# EAGLE design oresat-batteries-v1.1 (EAGLE 8.3.2)
Oresat Battery Management Board v0 Andrew Greenberg Austin Joseph Haneef Mubarak
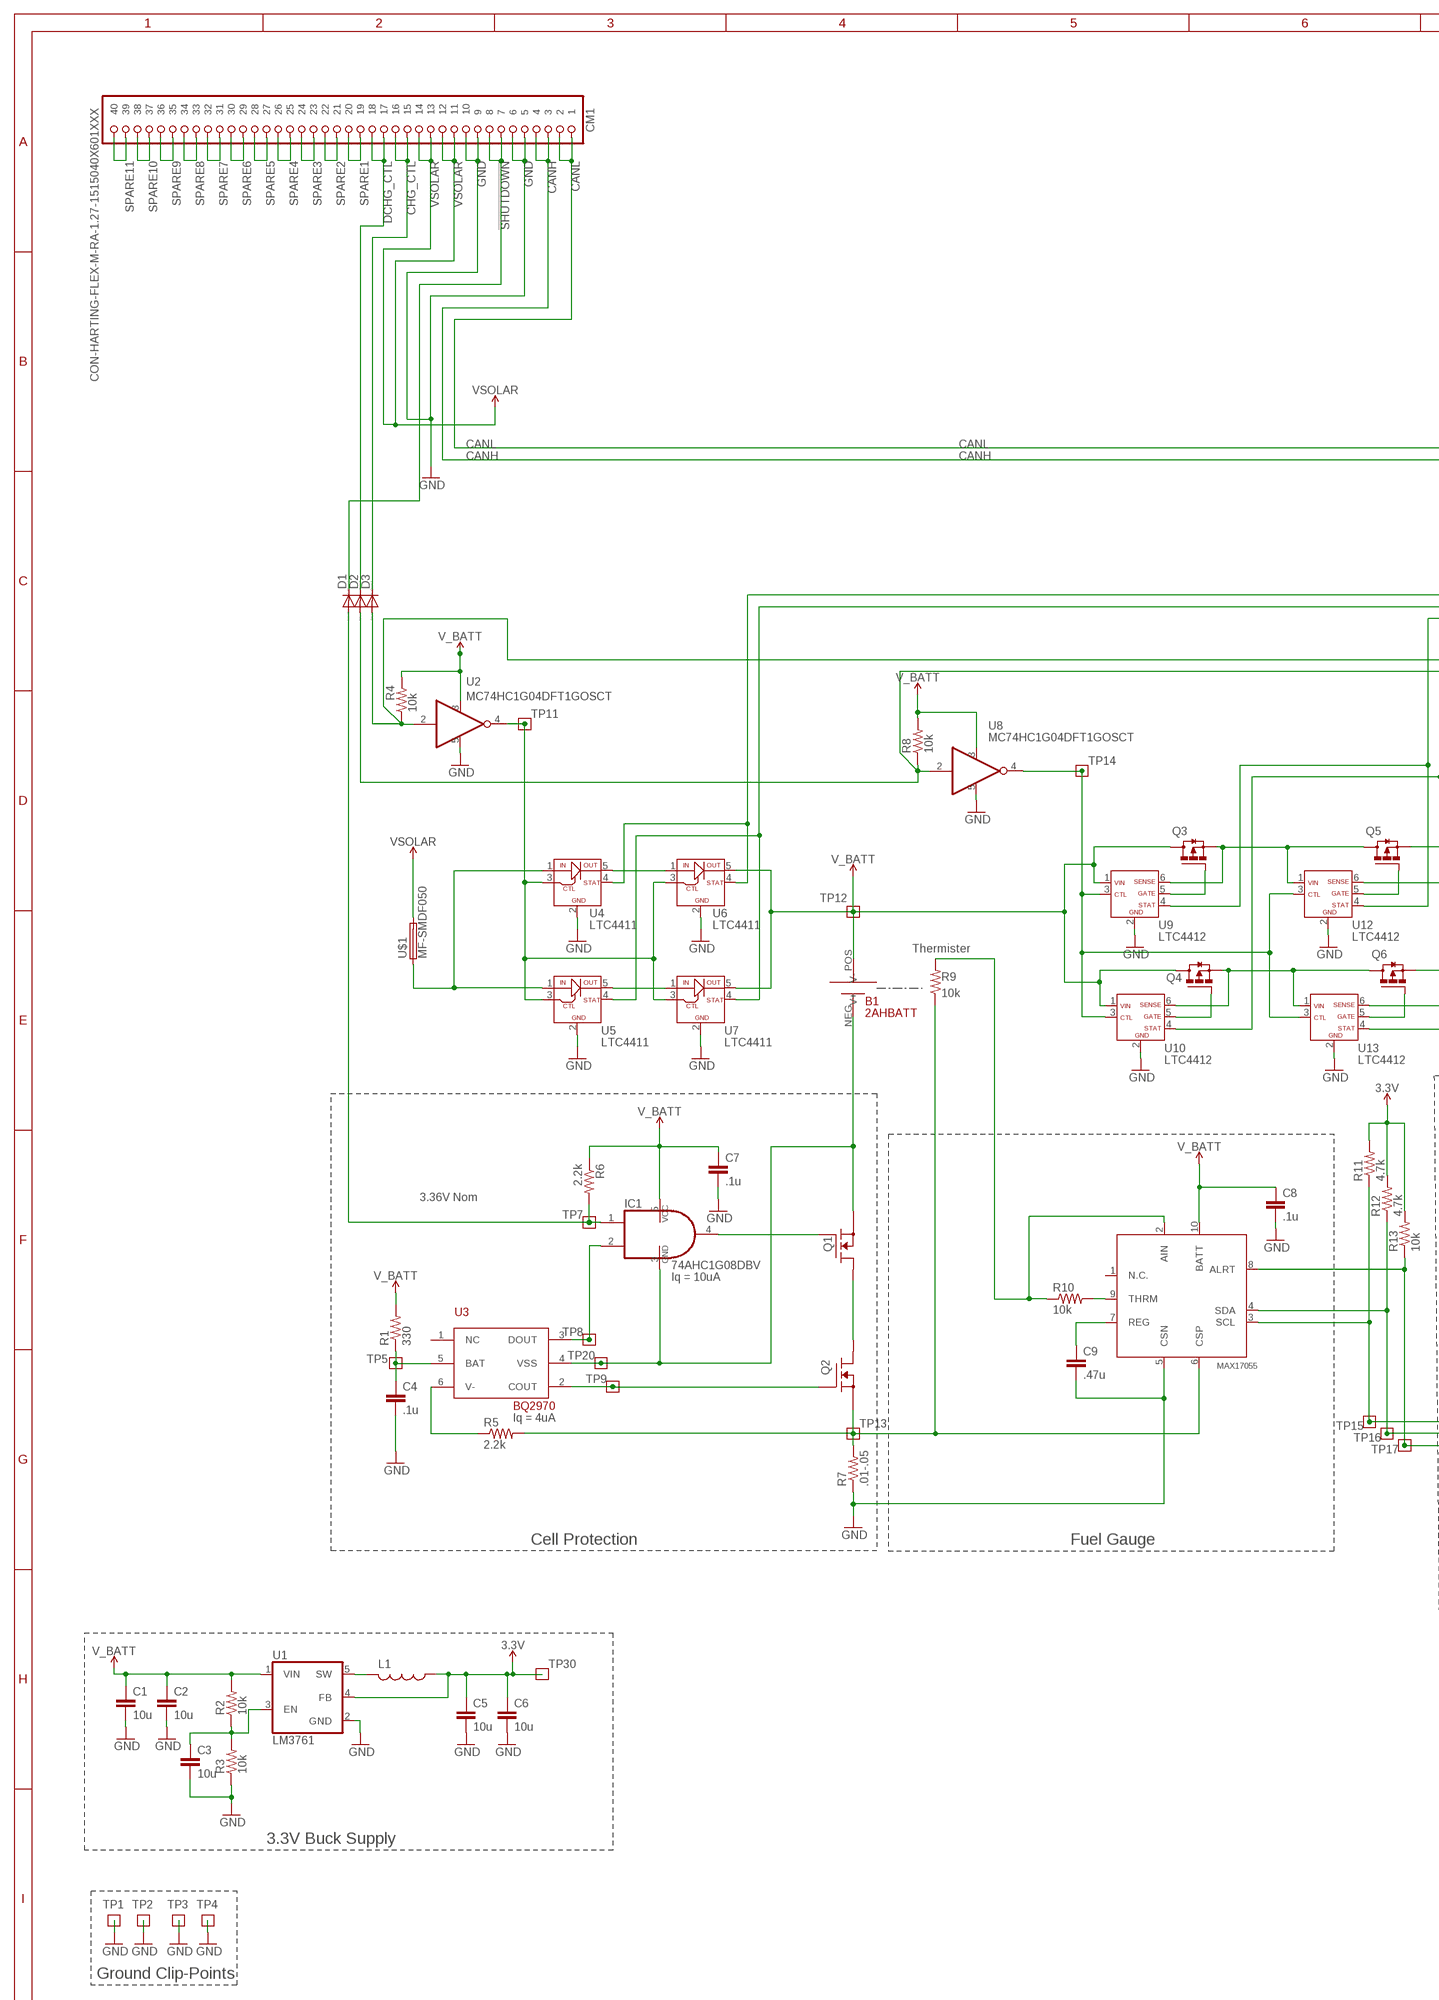
[diagram p0: schematic, sheet 1, part 1 of 2]
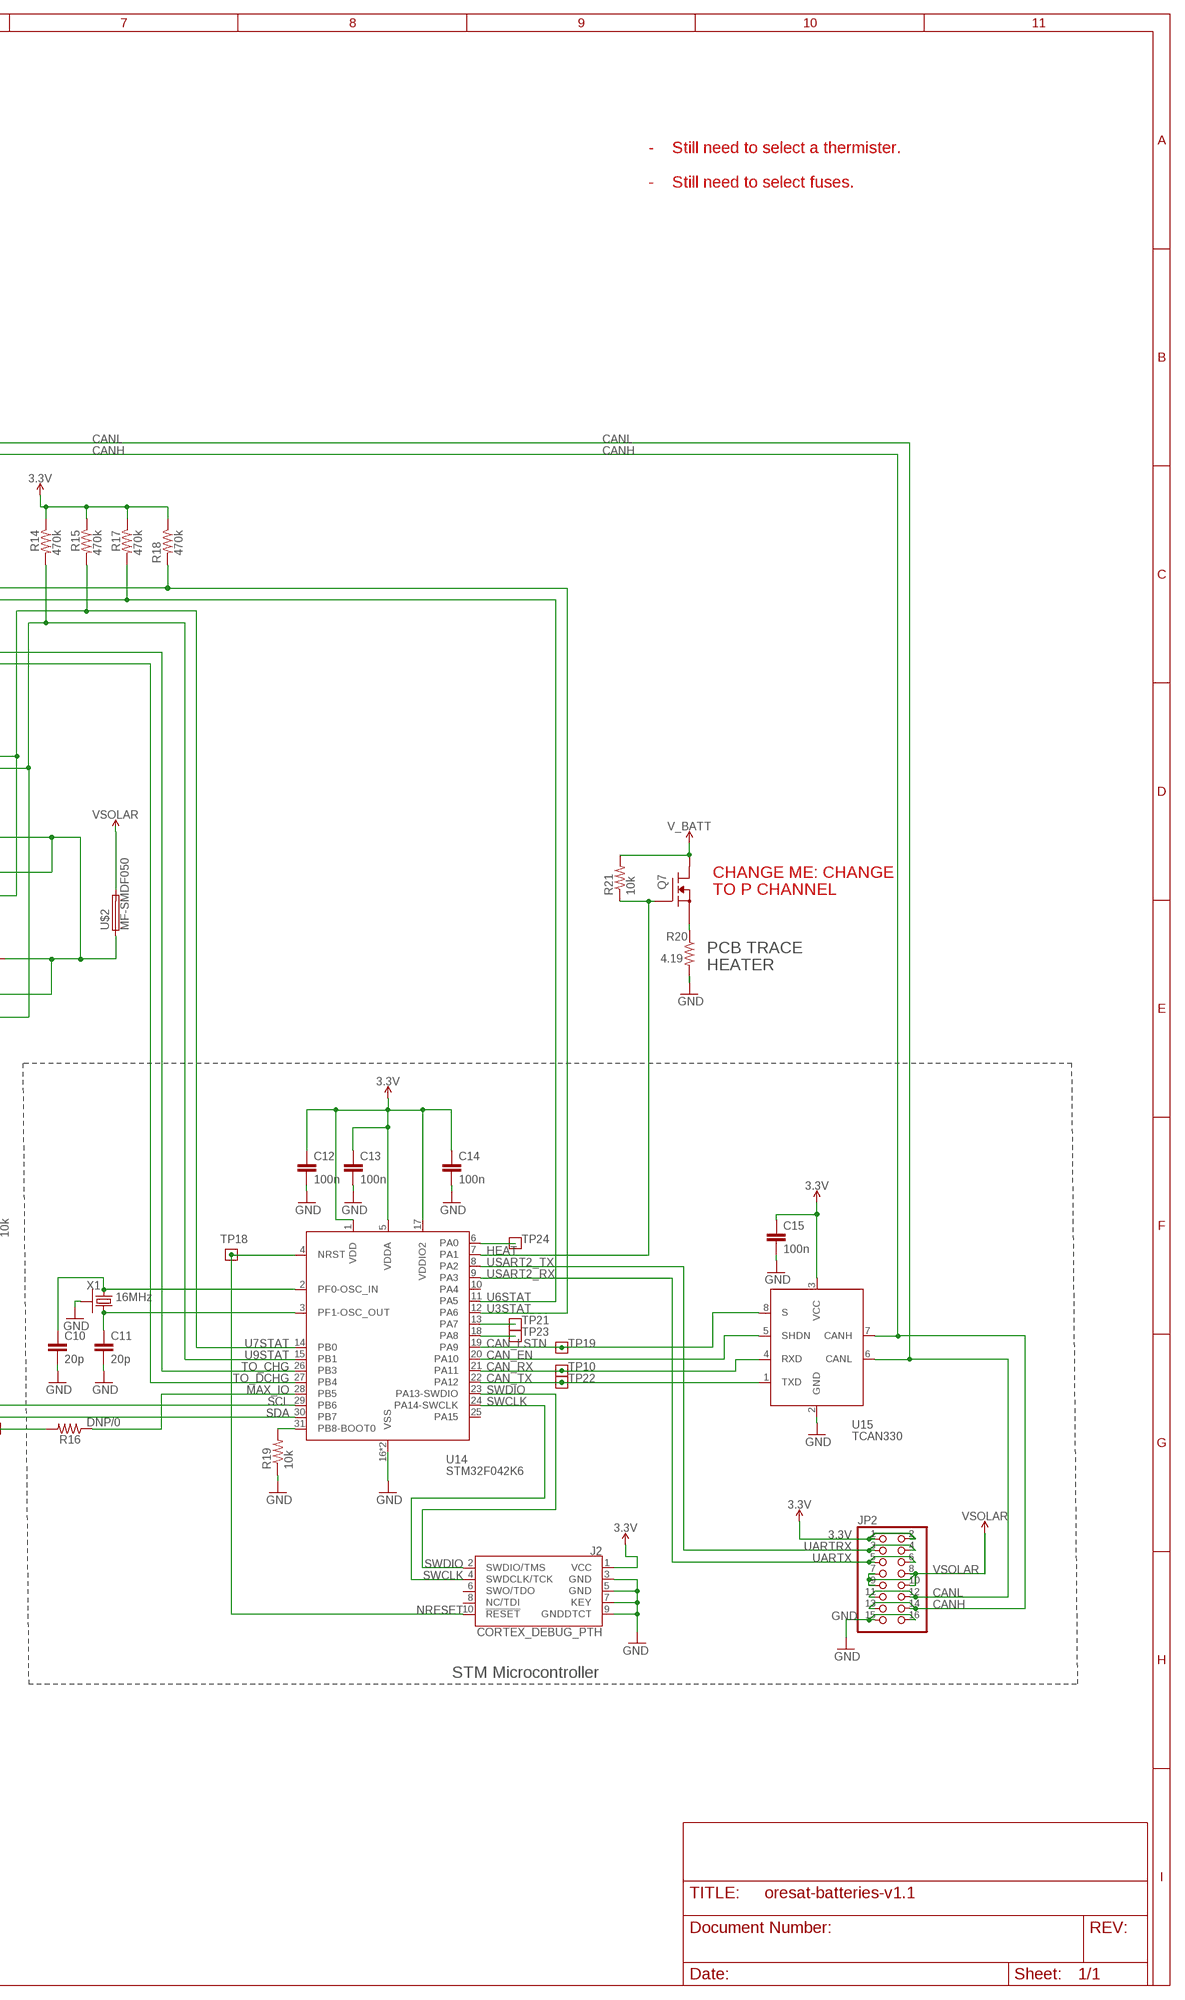
[diagram p1: schematic, sheet 1, part 2 of 2]

## Parts
B1  2AHBATT  [2AH_605060]
C1  10u  C-EUC0805  [C0805]
C2  10u  C-EUC0805  [C0805]
C3  10u  C-EUC0805  [C0805]
C4  .1u  C-EUC0603  [C0603]
C5  10u  C-EUC0805  [C0805]
C6  10u  C-EUC0805  [C0805]
C7  .1u  C-EUC0603  [C0603]
C8  .1u  C-EUC0603  [C0603]
C9  .47u  C-EUC0603  [C0603]
C10  20p  C-EUC0603  [C0603]
C11  20p  C-EUC0603  [C0603]
C12  100n  C-EUC0603  [C0603]
C13  100n  C-EUC0603  [C0603]
C14  100n  C-EUC0603  [C0603]
C15  100n  C-EUC0603  [C0603]
CM1  CON-HARTING-FLEX-M-RA-1.27-1515040X601XXX  [CON-1.27-M-RA-HARTING-1515040X601XXX]
D1  CMDD6001  [SOD323]
D2  CMDD6001  [SOD323]
D3  CMDD6001  [SOD323]
IC1  74AHC1G08DBV  [SOT23-5]
J2  CORTEX_DEBUG_PTH  [2X5-PTH-1.27MM]
JP2  PINHD-2X8  [2X08]
L1  L-USL2012C  [L2012C]
Q1  CSD16340Q3  [Q3]
Q2  CSD16340Q3  [Q3]
Q3  TPN4R712MD  [TSON-ADVANCE-3X3]
Q4  TPN4R712MD  [TSON-ADVANCE-3X3]
Q5  TPN4R712MD  [TSON-ADVANCE-3X3]
Q6  TPN4R712MD  [TSON-ADVANCE-3X3]
Q7  CSD16340Q3  [Q3]
R1  330  R-US_R0603  [R0603]
R2  10k  R-US_R0603  [R0603]
R3  10k  R-US_R0603  [R0603]
R4  10k  R-US_R0603  [R0603]
R5  2.2k  R-US_R0603  [R0603]
R6  2.2k  R-US_R0603  [R0603]
R7  .01-.05  R-US_R2512  [R2512]
R8  10k  R-US_R0603  [R0603]
R9  10k  R-US_R0603  [R0603]
R10  10k  R-US_R0603  [R0603]
R11  4.7k  R-US_R0603  [R0603]
R12  4.7k  R-US_R0603  [R0603]
R13  10k  R-US_R0603  [R0603]
R14  470k  R-US_R0603  [R0603]
R15  470k  R-US_R0603  [R0603]
R16  DNP/0  R-US_R0603  [R0603]
R17  470k  R-US_R0603  [R0603]
R18  470k  R-US_R0603  [R0603]
R19  10k  R-US_R0603  [R0603]
R20  4.19  RES_HEATER  [RES_HEATER]
R21  10k  R-US_R0603  [R0603]
TP1  TP  [2MM_TP]
TP2  TP  [2MM_TP]
TP3  TP  [2MM_TP]
TP4  TP  [2MM_TP]
TP5  TP  [2MM_TP]
TP7  TP  [2MM_TP]
TP8  TP  [2MM_TP]
TP9  TP  [2MM_TP]
TP10  TP  [2MM_TP]
TP11  TP  [2MM_TP]
TP12  TP  [2MM_TP]
TP13  TP  [2MM_TP]
TP14  TP  [2MM_TP]
TP15  TP  [2MM_TP]
TP16  TP  [2MM_TP]
TP17  TP  [2MM_TP]
TP18  TP  [2MM_TP]
TP19  TP  [2MM_TP]
TP20  TP  [2MM_TP]
TP21  TP  [2MM_TP]
TP22  TP  [2MM_TP]
TP23  TP  [2MM_TP]
TP24  TP  [2MM_TP]
TP30  TP  [2MM_TP]
U1  LM3761  [SOT23-5]
U2  MC74HC1G04DFT1GOSCT  [SC70-5]
U3  BQ2970  [PSOP6]
U4  LTC4411  [SOT23-5-B]
U5  LTC4411  [SOT23-5-B]
U6  LTC4411  [SOT23-5-B]
U7  LTC4411  [SOT23-5-B]
U8  MC74HC1G04DFT1GOSCT  [SC70-5]
U9  LTC4412  [SOT23-6]
U10  LTC4412  [SOT23-6]
U11  MAX17055  [TDFN-10L]
U12  LTC4412  [SOT23-6]
U13  LTC4412  [SOT23-6]
U14  STM32F042K6  [QFP32-7X7]
U15  TCAN330  [SOT23-8_TI-DCN]
U$1  MF-SMDF050  [MF-SMDF050]
U$2  MF-SMDF050  [MF-SMDF050]
X1  16MHz  CRYSTAL-WITH-GND  [CRYSTAL_2.5X2]

## Nets
3.3V: C5.1 C6.1 C12.1 C13.1 C14.1 C15.1 J2.1(VCC) JP2.1 JP2.2 L1.1 R11.2 R12.2 R13.2 R14.1 R15.1 R17.1 R18.1 TP30.P$1 U1.4(FB) U14.1(VDD) U14.5(VDDA) U14.17(VDDIO2) U15.3(VCC)
4411_MT: U4.5(OUT) U6.1(IN)
4411MB: U5.5(OUT) U7.1(IN)
!SHUTDOWN: CM1.7 CM1.8 D1.1(C)
ALERT: R13.1 R16.2 TP17.P$1 U11.8(ALRT)
ANDDRIVE: IC1.4(O) Q1.P$4(G)
BATT-: B1.NEG(V-) IC1.3(GND) Q1.P$1(S) Q1.P$2(S) Q1.P$3(S) TP20.P$1 U3.4(VSS)
BETSHUT: Q1.P$5(D) Q1.P$6(D) Q1.P$7(D) Q1.P$8(D) Q1.P$9(D) Q2.P$5(D) Q2.P$6(D) Q2.P$7(D) Q2.P$8(D) Q2.P$9(D)
BGDOUT: IC1.2(I1) TP8.P$1 U3.3(DOUT)
BQBAT: C4.1 R1.1 TP5.P$1 U3.5(BAT)
BQCOUT: Q2.P$4(G) TP9.P$1 U3.2(COUT)
BQVMIN: R5.1 U3.6(V-)
C_SENSE: Q2.P$1(S) Q2.P$2(S) Q2.P$3(S) R5.2 R7.2 R9.1 TP13.P$1 U11.6(CSP)
CAN_EN: U14.20(PA10) U15.5(SHDN)
CAN_LSTN: TP19.P$1 U14.19(PA9) U15.8(S)
CAN_RX: TP10.P$1 U14.21(PA11) U15.4(RXD)
CAN_TX: TP22.P$1 U14.22(PA12) U15.1(TXD)
CANH: CM1.3 CM1.4 JP2.13 JP2.14 U15.7(CANH)
CANL: CM1.1 CM1.2 JP2.11 JP2.12 U15.6(CANL)
CHG_CTL: CM1.15 CM1.16 D3.1(C)
CHG_SHD: TP11.P$1 U2.4(OUT) U4.3(CTL) U5.3(CTL) U6.3(CTL) U7.3(CTL)
DCHG_CTL: CM1.17 CM1.18 D2.1(C)
DSCHG_SHD: TP14.P$1 U8.4(OUT) U9.3(CTL) U10.3(CTL) U12.3(CTL) U13.3(CTL)
GND: C1.2 C2.2 C3.2 C4.2 C5.2 C6.2 C7.2 C8.2 C9.2 C10.2 C11.2 C12.2 C13.2 C14.2 C15.2 CM1.5 CM1.6 CM1.9 CM1.10 J2.3(GND) J2.5(GND) J2.7(KEY) J2.9(GNDDTCT) JP2.15 JP2.16 R3.1 R7.1 R19.1 R20.V- TP1.P$1 TP2.P$1 TP3.P$1 TP4.P$1 U1.2(GND) U2.5(GND) U4.2(GND) U5.2(GND) U6.2(GND) U7.2(GND) U8.5(GND) U9.2(GND) U10.2(GND) U11.5(CSN) U12.2(GND) U13.2(GND) U14.16(VSS) U14.32(VSS) U15.2(GND) X1.2(SHIELD) X1.4(SHIELD)
HEAT: Q7.P$4(G) R21.1 U14.7(PA1)
INFUSE: U4.1(IN) U5.1(IN) U$1.1
MAX_IO: R16.1 U14.28(PB5)
N$1: L1.2 U1.5(SW)
N$2: R19.2 U14.31(PB8-BOOT0)
N$4: TP23.P$1 U14.18(PA8)
N$7: C3.1 R2.1 R3.2 U1.3(EN)
N$8: Q5.4(G) U12.5(GATE)
N$11: Q3.1(S) Q3.2(S) Q3.3(S) Q5.5(D) Q5.6(D) Q5.7(D) Q5.8(D) U9.6(SENSE) U12.1(VIN)
N$12: Q3.4(G) U9.5(GATE)
N$13: Q7.P$1(S) Q7.P$2(S) Q7.P$3(S) R20.V+
N$14: TP24.P$1 U14.6(PA0)
N$16: Q6.4(G) U13.5(GATE)
N$18: Q4.1(S) Q4.2(S) Q4.3(S) Q6.5(D) Q6.6(D) Q6.7(D) Q6.8(D) U10.6(SENSE) U13.1(VIN)
N$19: Q4.4(G) U10.5(GATE)
NRESET: J2.10(!RESET) TP18.P$1 U14.4(NRST)
OSC_IN: C10.1 U14.2(PF0-OSC_IN) X1.1
OSC_OUT: C11.1 U14.3(PF1-OSC_OUT) X1.3
OUTFUSE: Q5.1(S) Q5.2(S) Q5.3(S) Q6.1(S) Q6.2(S) Q6.3(S) U12.6(SENSE) U13.6(SENSE) U$2.1
REG: C9.1 U11.7(REG)
SCL: R11.1 TP15.P$1 U11.3(SCL) U14.29(PB6)
SDA: R12.1 TP16.P$1 U11.4(SDA) U14.30(PB7)
SPARE1: CM1.19 CM1.20
SPARE2: CM1.21 CM1.22
SPARE3: CM1.23 CM1.24
SPARE4: CM1.25 CM1.26
SPARE5: CM1.27 CM1.28
SPARE6: CM1.29 CM1.30
SPARE7: CM1.31 CM1.32
SPARE8: CM1.33 CM1.34
SPARE9: CM1.35 CM1.36
SPARE10: CM1.37 CM1.38
SPARE11: CM1.39 CM1.40
SWCLK: J2.4(SWDCLK/TCK) U14.24(PA14-SWCLK)
SWDIO: J2.2(SWDIO/TMS) U14.23(PA13-SWDIO)
SYSSHD: D1.2(A) IC1.1(I0) R6.2 TP7.P$1
TEMPSENSE: R9.2 R10.1 U11.2(AIN)
THRM: R10.2 U11.9(THRM)
TO_CHG: D3.2(A) R4.1 U2.2(INA) U14.26(PB3)
TO_DCHG: D2.2(A) R8.1 U8.2(INA) U14.27(PB4)
TP21: TP21.P$1 U14.13(PA7)
U3STAT: R18.2 U4.4(STAT) U6.4(STAT) U14.12(PA6)
U6STAT: R17.2 U5.4(STAT) U7.4(STAT) U14.11(PA5)
U7STAT: R15.2 U9.4(STAT) U12.4(STAT) U14.14(PB0)
U9STAT: R14.2 U10.4(STAT) U13.4(STAT) U14.15(PB1)
USART2_RX: JP2.5 JP2.6 U14.9(PA3)
USART2_TX: JP2.3 JP2.4 U14.8(PA2)
V_BATT: B1.POS(V+) C1.1 C2.1 C7.1 C8.1 IC1.5(VCC) Q3.5(D) Q3.6(D) Q3.7(D) Q3.8(D) Q4.5(D) Q4.6(D) Q4.7(D) Q4.8(D) Q7.P$5(D) Q7.P$6(D) Q7.P$7(D) Q7.P$8(D) Q7.P$9(D) R1.2 R2.2 R4.2 R6.1 R8.2 R21.2 TP12.P$1 U1.1(VIN) U2.3(VCC) U6.5(OUT) U7.5(OUT) U8.3(VCC) U9.1(VIN) U10.1(VIN) U11.10(BATT)
VSOLAR: CM1.11 CM1.12 CM1.13 CM1.14 JP2.7 JP2.8 JP2.9 JP2.10 U$1.2 U$2.2
Unconnected: J2.6(SWO/TDO) J2.8(NC/TDI) U3.1(NC) U11.1(N.C.) U14.10(PA4) U14.25(PA15)

## Notes on the sheet
- -    Still need to select a thermister.
  
  -    Still need to select fuses.
- CHANGE ME: CHANGE 
  TO P CHANNEL
- Thermister
- PCB TRACE
  HEATER
- 3.36V Nom
- HEAT
- Iq = 10uA | USART2_TX
- USART2_RX
- CAN_LSTN
- CAN_EN
- CAN_RX
- CAN_TX
- SWDIO
- Iq = 4uA | SCL | SWCLK
- SDA
- Cell Protection | Fuel Gauge
- UARTRX
- UARTX
- VSOLAR
- CANL
- CANH
- GND
- STM Microcontroller
- 3.3V Buck Supply
- Ground Clip-Points

## Library data of the parts
B1 = oresat-batteries:2AHBATT
C1-C15 = rcl:C-EU: CAPACITOR, European symbol
CM1 = oresat-eagle:CON-HARTING-FLEX-M-RA-1.27-1515040X601XXX
D1-D3 = CMMDD6001:CMDD6001
IC1 = 74xx-little-us:74*1G08: 2-input AND gate
J2 = SparkFun-Connectors:CORTEX_DEBUG: Cortex Debug Connector - 10 pin Supports JTAG debug, Serial Wire debug, and Serial Wire Viewer. PTH and SMD connector options available. General Connector Information <http://infocenter.arm.com/help/topic/com.arm.doc.faqs/attached/13634/cortex_debug_connectors.pdf> Products: PTH Connector <http://www.digikey.com/product-detail/en/cnc-tech/3220-10-0100-00/1175-1627-ND/3883661> -via Digi-Key SparkFun PSoc <https://www.sparkfun.com/products/13229> SparkFun T <https://www.sparkfun.com/products/13810>
JP2 = pinhead:PINHD-2X8: PIN HEADER
L1 = rcl:L-US: INDUCTOR, American symbol
Q1 Q2 Q7 = oresat-batteries:CSD16340Q3
Q3-Q6 = tpn4r712md-pmosfet:TPN4R712MD
R1-R19 R21 = rcl:R-US_: RESISTOR, American symbol
R20 = oresat-batteries:RES_HEATER
TP1-TP5 TP7-TP24 TP30 = oresat-batteries:TP
U1 = oresat-batteries:LM3761: http://www.digikey.com/product-detail/en/texas-instruments/LM3671MF-3.3-NOPB/LM3671MF-3.3-NOPBCT-ND/1590190
U2 U8 = MC74HC1G04DFT1GOSCT:MC74HC1G04DFT1GOSCT
U3 = oresat-batteries:BQ2970
U4-U7 = ltc4411:LTC4411
U9 U10 U12 U13 = ltc4412:LTC4412
U11 = max17055:MAX17055
U14 = oresat-batteries:STM32F042K6
U15 = oresat-batteries:TCAN330
U$1 U$2 = fuse:MF-SMDF: MF-SMDF Series - PRC Resettable Fuses Source: http://www.farnell.com/datasheets/716597.pdf
X1 = low-gain-radio:CRYSTAL-WITH-GND

## Board
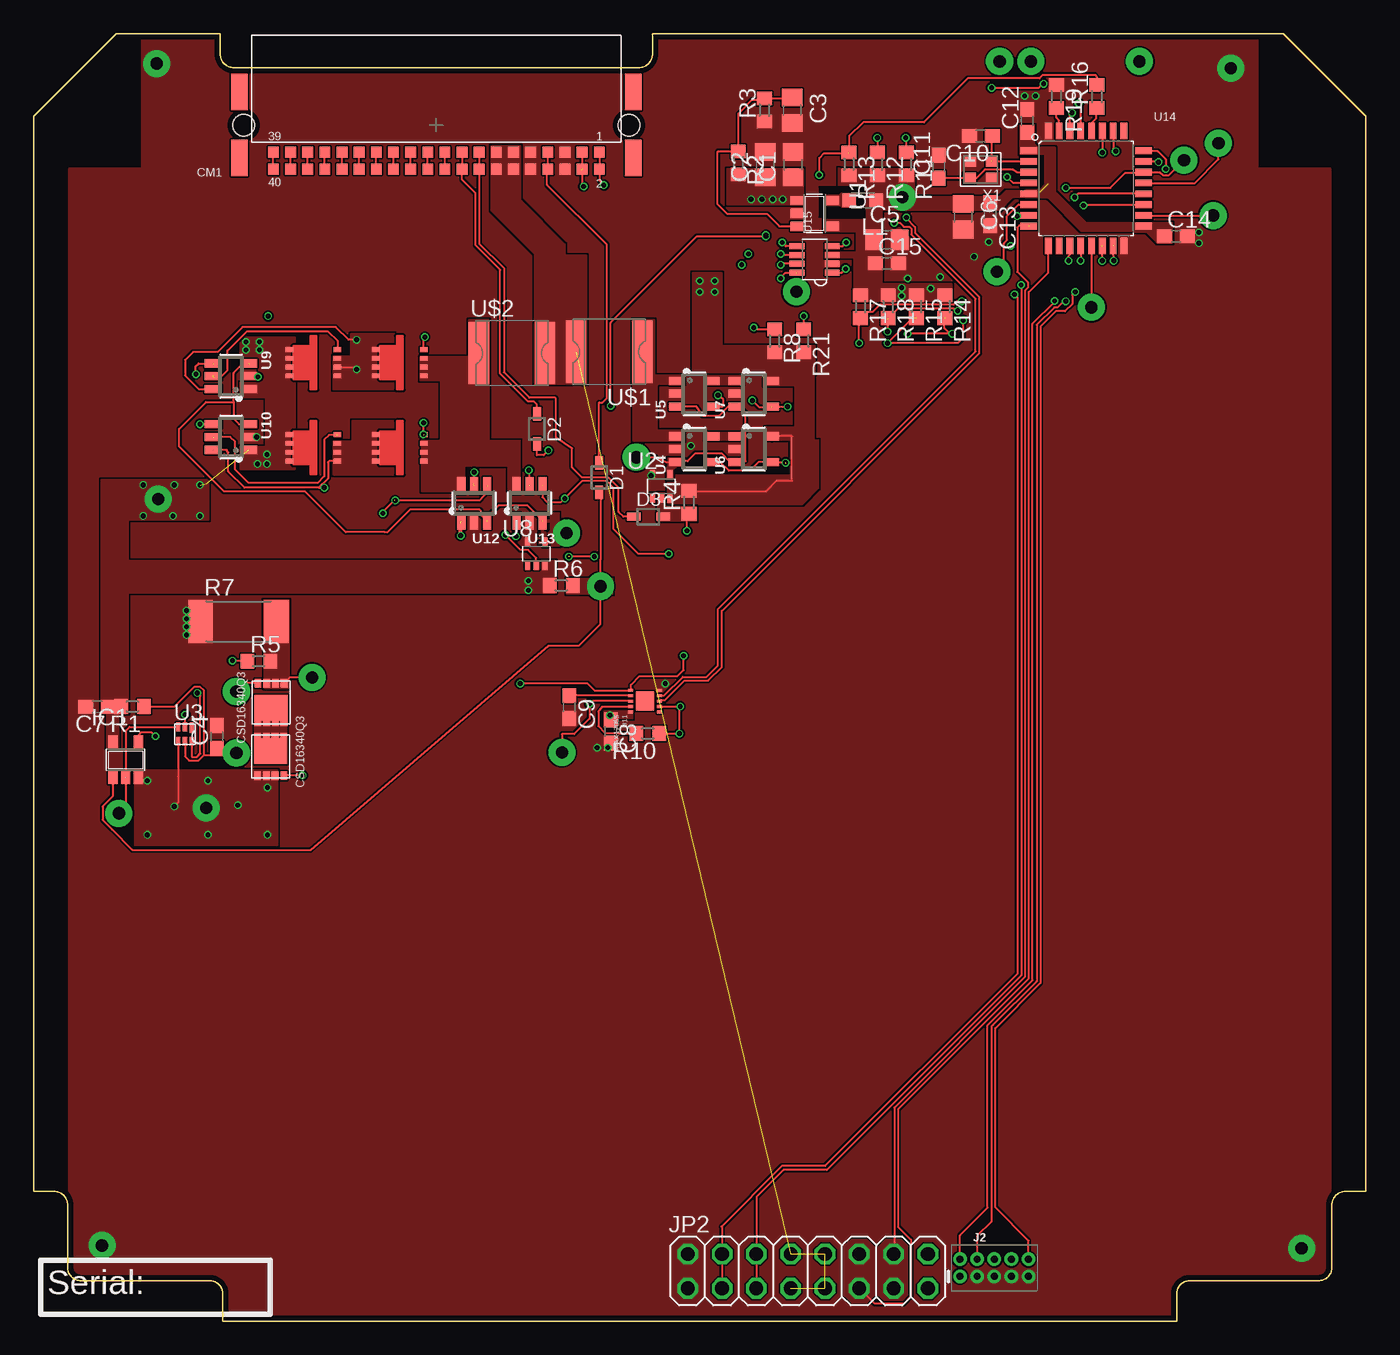
[diagram p2: board, top side]
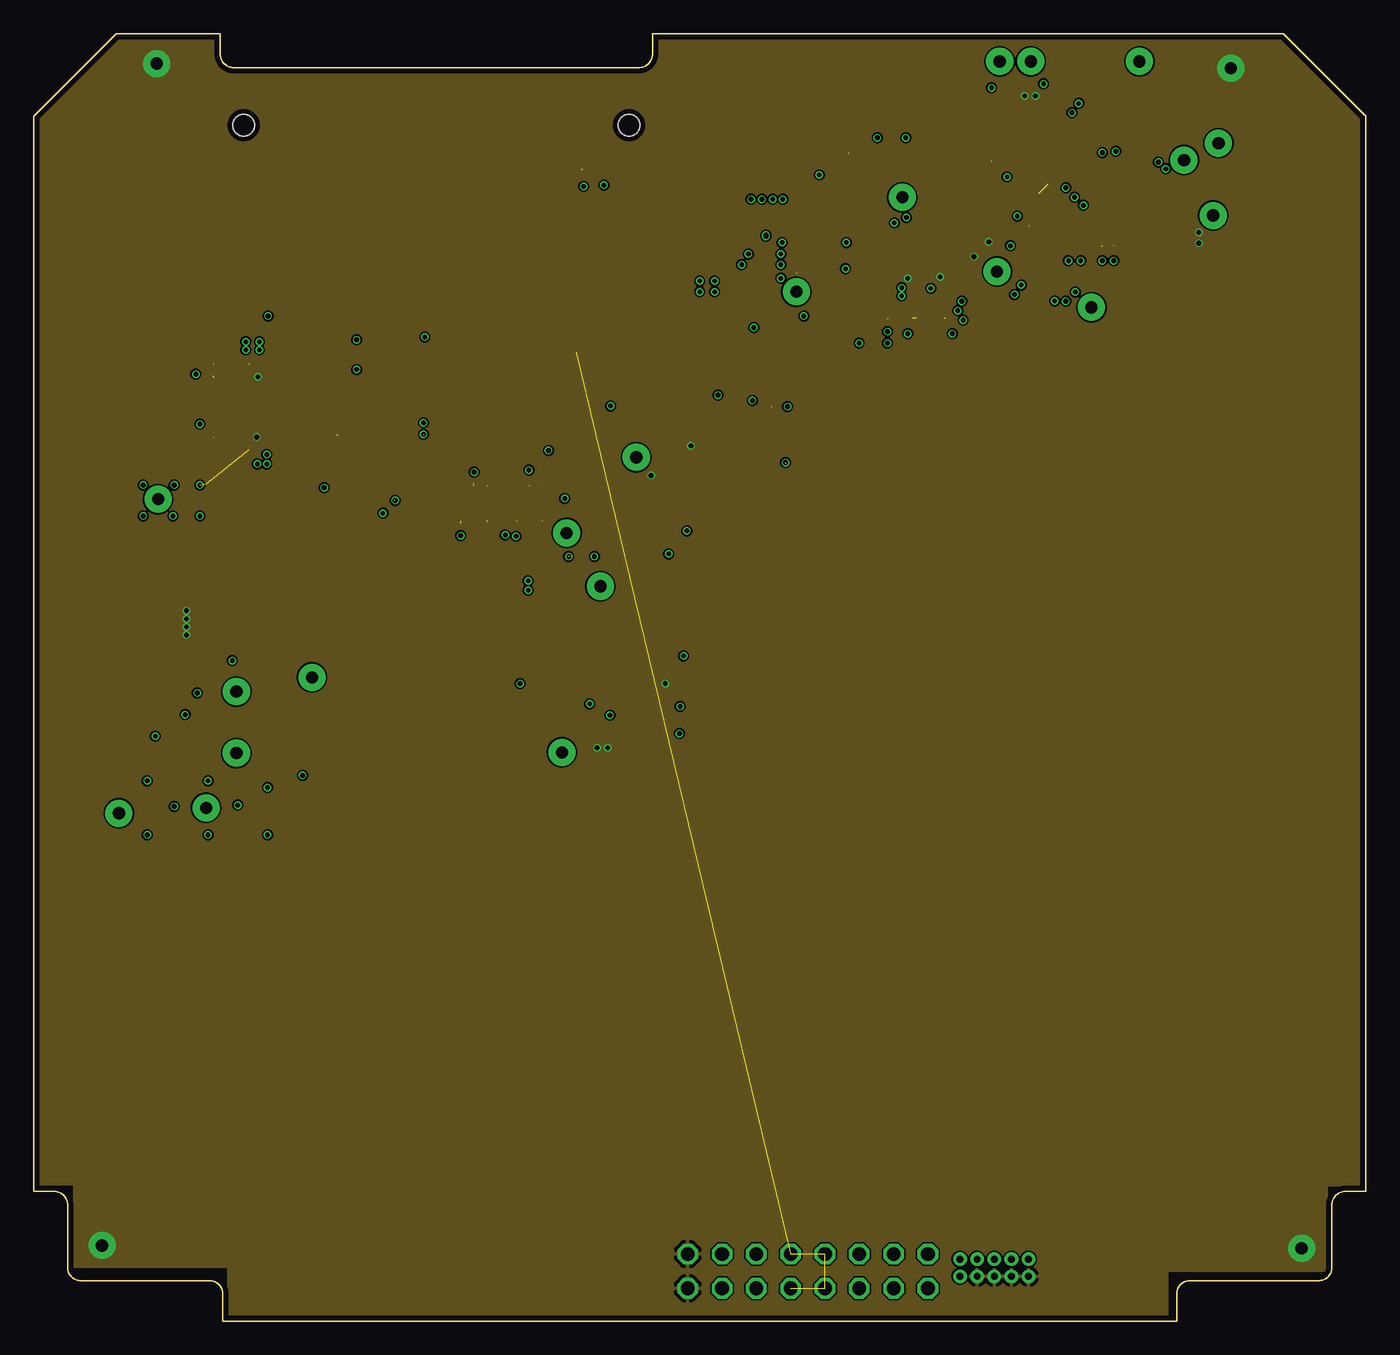
[diagram p3: board, inner layer Route2]
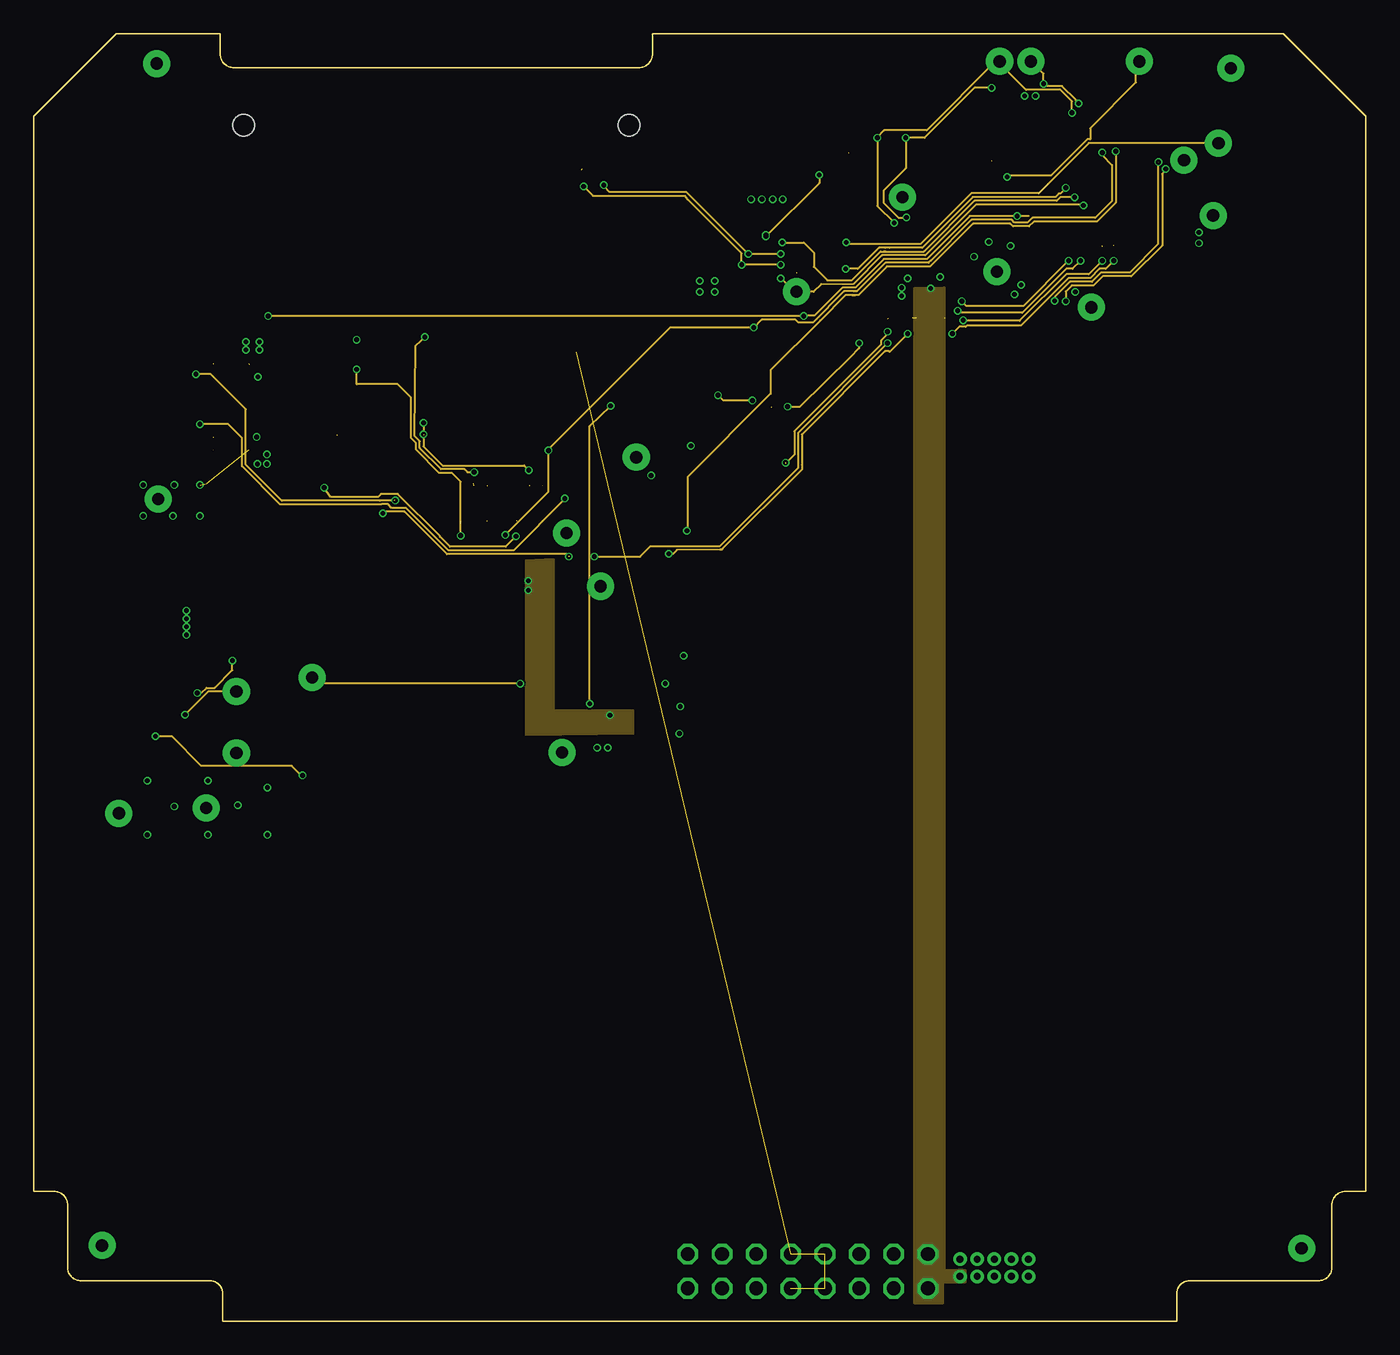
[diagram p4: board, inner layer route]
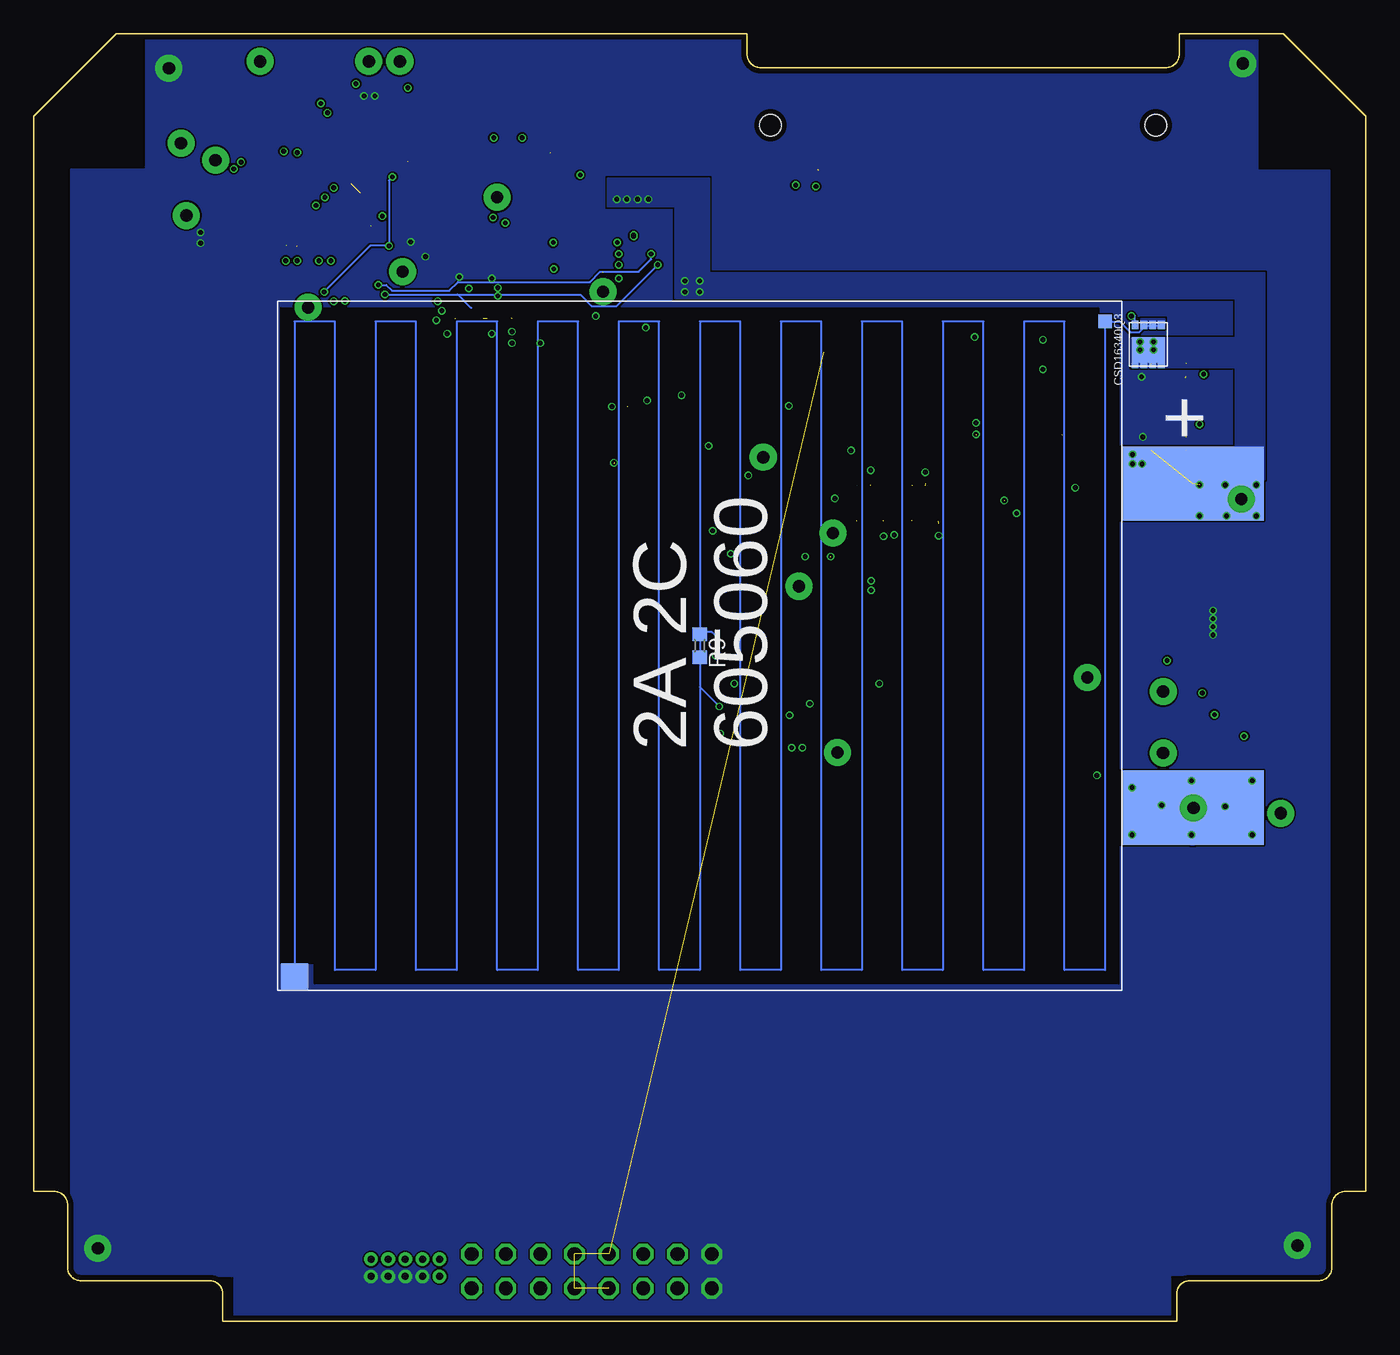
[diagram p5: board, bottom side, seen from below]

Size 98.6 x 95.3 mm. Coordinates in mm from the lower left corner, seen from the top.
Copper layers (1*2*15*16): Top 0.035559375mm / dielectric 0.17018125mm / Route2 0.01778125mm / dielectric 47mil / route 0.01778125mm / dielectric 0.17018125mm / Bottom 0.035559375mm
Design rules "oshpark-4layer": minimum track width 5mil, minimum drill 10mil, track to track 5mil, track to pad 5mil, pad to pad 5mil, via to via 5mil, smd to smd 5mil, copper to edge 15mil, drill to drill 6mil, minimum pad ring 4mil, minimum via ring 4mil, stop-mask expansion 2.5mil, vias tented up to drill 0mil, thermal gap 10mil
tRestrict: area 58.1,81.8 to 61.5,84

### Footprints (pad centres in the part's own frame; a part is rotated, then mirrored left to right if it is on the bottom)
2AH_605060 = smd 5.5 x 10.5: NEG -12,-36.5; POS 12,-36.5
C0805 = smd 1.3 x 1.5: 1 -0.95,0; 2 0.95,0
C0603 = smd 1.1 x 1: 1 -0.85,0; 2 0.85,0
CON-1.27-M-RA-HARTING-1515040X601XXX = smd 0.8 x 0.8: 1 -12.065,2; 2 -12.065,3.27; 3 -10.795,2; 4 -10.795,3.27; 5 -9.525,2; 6 -9.525,3.27; 7 -8.255,2; 8 -8.255,3.27; 9 -6.985,2; 10 -6.985,3.27; 11 -5.715,2; 12 -5.715,3.27; 13 -4.445,2; 14 -4.445,3.27; 15 -3.175,2; 16 -3.175,3.27; 17 -1.905,2; 18 -1.905,3.27; 19 -0.635,2; 20 -0.635,3.27; 21 0.635,2; 22 0.635,3.27; 23 1.905,2; 24 1.905,3.27; 25 3.175,2; 26 3.175,3.27; 27 4.445,2; 28 4.445,3.27; 29 5.715,2; 30 5.715,3.27; 31 6.985,2; 32 6.985,3.27; 33 8.255,2; 34 8.255,3.27; 35 9.525,2; 36 9.525,3.27; 37 10.795,2; 38 10.795,3.27; 39 12.065,2; 40 12.065,3.27 | smd 1.2 x 2.7: PAD1 -14.575,-2.45; PAD2 14.575,-2.45; PAD3 14.575,2.45; PAD4 -14.575,2.45 | hole 1.6: 14.275,0; -14.275,0
SOD323 = smd 1 x 0.6: 1 -1.1,0; 2 1.1,0
SOT23-5 = smd 0.69 x 0.99: 1 -0.95,-1.29; 2 0,-1.29; 3 0.95,-1.29; 4 0.95,1.3; 5 -0.95,1.3
2X5-PTH-1.27MM = drill 0.508 pad 1: 1 -2.54,-0.635; 2 -2.54,0.635; 3 -1.27,-0.635; 4 -1.27,0.635; 5 0,-0.635; 6 0,0.635; 7 1.27,-0.635; 8 1.27,0.635; 9 2.54,-0.635; 10 2.54,0.635
2X08 = drill 1.016 octagon: 1 -8.89,-1.27; 2 -8.89,1.27; 3 -6.35,-1.27; 4 -6.35,1.27; 5 -3.81,-1.27; 6 -3.81,1.27; 7 -1.27,-1.27; 8 -1.27,1.27; 9 1.27,-1.27; 10 1.27,1.27; 11 3.81,-1.27; 12 3.81,1.27; 13 6.35,-1.27; 14 6.35,1.27; 15 8.89,-1.27; 16 8.89,1.27
L2012C = smd 1 x 1: 1 -1,0; 2 1,0
Q3 = smd 0.5 x 0.63: P$1 -0.975,-1.435; P$2 -0.325,-1.435; P$3 0.325,-1.435; P$4 0.975,-1.435; P$5 0.975,1.435; P$6 0.325,1.435; P$7 -0.325,1.435; P$8 -0.975,1.435 | smd 2.45 x 1.9: P$9 0,0.39
TSON-ADVANCE-3X3 = smd 0.35 x 0.55: 1 -0.975,-1.775; 2 -0.325,-1.775; 3 0.325,-1.775; 4 0.975,-1.775; 5 0.975,1.775; 6 0.325,1.775; 7 -0.325,1.775; 8 -0.975,1.775
R0603 = smd 1 x 1.1: 1 -0.85,0; 2 0.85,0
R2512 = smd 1.8 x 3.2: 1 -2.8,0; 2 2.8,0
RES_HEATER = smd 1 x 1: V+ -24,30 | smd 2 x 2: V- 24.5,-30
2MM_TP = drill 0.9 pad 2: P$1 0,0
SC70-5 = smd 0.4 x 0.7: 1 -0.65,-0.85; 2 0,-0.85; 3 0.65,-0.85; 4 0.65,0.85; 5 -0.65,0.85
PSOP6 = smd 0.3 x 0.75: 1 -0.5,-0.475 | smd 0.3 x 0.65: 2 0,-0.525; 3 0.5,-0.525; 4 0.5,0.525; 5 0,0.525; 6 -0.5,0.525
SOT23-5-B = smd 0.6 x 1.05: 1 0.95,1.35; 2 0,1.35; 3 -0.95,1.35; 4 -0.95,-1.35; 5 0.95,-1.35
SOT23-6 = smd 0.6 x 1.25: 1 0.95,1.31; 2 0,1.31; 3 -0.95,1.31; 4 -0.95,-1.31; 5 0,-1.31; 6 0.95,-1.31
TDFN-10L = smd 0.2 x 0.35: 1 0.8,1.075; 2 0.4,1.075; 3 0,1.075; 4 -0.4,1.075; 5 -0.8,1.075; 6 -0.8,-1.075; 7 -0.4,-1.075; 8 0,-1.075; 9 0.4,-1.075; 10 0.8,-1.075 | smd 1.4 x 1.3: P$1 0,0
QFP32-7X7 = smd 1.2 x 0.5: 1 -4.25,2.8; 2 -4.25,2; 3 -4.25,1.2; 4 -4.25,0.4; 5 -4.25,-0.4; 6 -4.25,-1.2; 7 -4.25,-2; 8 -4.25,-2.8; 17 4.25,-2.8; 18 4.25,-2; 19 4.25,-1.2; 20 4.25,-0.4; 21 4.25,0.4; 22 4.25,1.2; 23 4.25,2; 24 4.25,2.8 | smd 0.5 x 1.2: 9 -2.8,-4.25; 10 -2,-4.25; 11 -1.2,-4.25; 12 -0.4,-4.25; 13 0.4,-4.25; 14 1.2,-4.25; 15 2,-4.25; 16 2.8,-4.25; 25 2.8,4.25; 26 2,4.25; 27 1.2,4.25; 28 0.4,4.25; 29 -0.4,4.25; 30 -1.2,4.25; 31 -2,4.25; 32 -2.8,4.25
SOT23-8_TI-DCN = smd 0.45 x 1.1: 1 -0.975,-1.3; 2 -0.325,-1.3; 3 0.325,-1.3; 4 0.975,-1.3; 5 0.975,1.3; 6 0.325,1.3; 7 -0.325,1.3; 8 -0.975,1.3
MF-SMDF050 = smd 1.5 x 4.6: 1 -2.45,0; 2 2.45,0
CRYSTAL_2.5X2 = smd 0.9 x 0.8: 1 -0.825,-0.625; 2 0.825,-0.625; 3 0.825,0.625; 4 -0.825,0.625

### Placement (x,y rotation side)
B1  49.3,50 90 bottom
C1  56.2,85.6 90 top
C2  54.15,85.6 90 top
C3  56.15,89.65 270 top
C4  13.55,43.25 90 top
C5  63.15,80.05 0 top
C6  68.8,81.75 270 top
C7  4.7,45.5 180 top
C8  42.7,43.65 270 top
C9  39.65,45.45 270 top
C10  70.1,87.75 180 top
C11  67,85.45 90 top
C12  73.55,88.85 90 top
C13  70.8,81.95 270 top
C14  84.55,80.3 0 top
C15  63.15,78.3 0 top
CM1  29.8,88.54 180 top
D1  41.85,62.45 270 top
D2  37.25,66.05 270 top
D3  45.5,59.55 0 top
IC1  6.8,41.55 0 top
J2  71.1,3.95 0 top
JP2  57.3,3.7 180 top
L1  61.35,82.95 180 top
Q1  17.54,41.8 0 top
Q2  17.56,45.8 180 top
Q3  20.7,70.95 90 top
Q4  20.7,64.65 90 top
Q5  27.1,70.95 90 top
Q6  27.1,64.65 90 top
Q7  16.1,72.3 180 bottom
R1  7.3,45.5 180 top
R2  52.15,85.75 270 top
R3  54.1,89.65 90 top
R4  48.5,60.6 90 top
R5  16.65,48.85 0 top
R6  39.05,54.45 0 top
R7  15.15,51.8 0 top
R8  54.85,72.55 270 top
R9  49.3,50 270 bottom
R10  45.45,43.5 180 top
R11  64.6,85.65 270 top
R12  62.45,85.65 270 top
R13  60.35,85.65 270 top
R14  67.45,75.1 270 top
R15  65.35,75.1 270 top
R16  78.7,90.65 90 top
R17  61.2,75.1 270 top
R18  63.25,75.1 270 top
R19  75.7,90.65 270 top
R20  49.3,50 270 bottom
R21  57,72.55 270 top
TP1  88.6,92.75 0 top
TP2  9.1,93.1 0 top
TP3  5.05,5.6 0 top
TP4  93.85,5.4 0 top
TP5  15,42.05 0 top
TP7  41.95,54.4 0 top
TP8  6.3,37.6 0 top
TP9  15,46.6 0 top
TP10  87.7,87.2 0 top
TP11  44.6,63.95 0 top
TP12  9.2,60.85 0 top
TP13  20.6,47.65 0 top
TP14  39.45,58.35 0 top
TP15  73.8,93.25 0 top
TP16  71.5,93.25 0 top
TP17  39.1,42.1 0 top
TP18  81.85,93.25 0 top
TP19  56.45,76.2 0 top
TP20  12.75,38 0 top
TP21  78.3,75.05 0 top
TP22  85.15,85.95 0 top
TP23  87.3,81.85 0 top
TP24  71.3,77.7 0 top
TP30  64.3,83.2 0 top
U1  57.8,82 270 top
U2  46.45,61.8 0 top
U3  11.19,43.45 180 top
U4  48.9,64.55 90 top
U5  48.9,68.65 90 top
U6  53.3,64.55 90 top
U7  53.3,68.65 90 top
U8  37.2,56.8 0 top
U9  14.6,69.95 270 top
U10  14.6,65.45 270 top
U11  45.25,45.9 270 top
U12  32.6,60.55 180 top
U13  36.7,60.55 180 top
U14  77.9,83.85 0 top
U15  57.8,78.6 90 top
U$1  42.6,71.75 180 top
U$2  35.4,71.65 0 top
U$7  [ORESAT-CARD-V0.5]  0,0 0 top
X1  70.1,85.25 180 top

### Tracks (layer width: path | path; a pad name or v marks a point on that pad's centre or on a via)
3.3V  (via drill 0.35)
  other vias: 64.25,76.5 66.4,76.45 64.25,75.9
  pour Top (no thermals): 58.6,78.75 60.7,78.75 60.7,75.5 62.8,75.5 62.8,85.25 61.65,85.25 61.65,81.5 58.5,81.5 58.5,80.7 60.9,80.7 60.9,79.1 58.6,79.1
  pour Top (no thermals): 81.55,81.3 84.25,81.3 84.25,79.8 83.2,79.8 82.4,80.6 81.55,80.6
  pour Top (no thermals): 74.25,83.2 72.45,83.2 71.5,82.25 62.35,82.25 62.35,83.25 71.55,83.25 72,83.7 74.25,83.7
  pour Top (no thermals): 73.05,86.4 73.05,88.55 74.05,88.55 74.05,87.15 74.25,86.95 74.25,86.4
  pour Top (no thermals): 73.45,83.15 73.45,83.75 74.5,83.75 74.9,84.15 74.9,86.4 73.1,86.4 73.05,86.9 75.55,86.9 75.6,86.85 75.6,83.6 77.9,81.3 82.35,81.3 82.4,81.25 82.4,80.75 82.35,80.7 77.55,80.7 75.1,83.15
  pour Top (no thermals): 62.8,75.5 67.95,75.5 67.95,76.75 62.8,76.75
  pour Top (no thermals): 59.6,85.35 65.15,85.3 65.15,82.25 59.6,82.3
  pour route (no thermals): 68.95,3.8 68.95,2.85 67.3,2.85 67.3,1.3 65.2,1.3 65.2,76.5 67.4,76.55 67.4,3.8
4411_MT
  pour Top (no thermals): 49.7,65.25 52.4,65.25 52.4,65.75 49.7,65.75
4411MB
  pour Top (no thermals): 49.8,69.35 52.5,69.35 52.5,69.95 49.8,69.95
!SHUTDOWN
  Top 0.152: D1.1 41.85,68 42.1,68 42.42,68.32 42.42,79.68 38,84.1 38,85.22 CM1.8 CM1.7
ALERT  (via drill 0.35)  (1 unrouted)
  Top 0.152: TP17.P$1 39.1,43.45 40,43.45 41.15,44.6 v41.15,45.7 41.35,45.9 U11.8 44.2,45.9 | v58.15,84.85 58.15,86.1 58.5,86.45 60.35,86.45 60.35,87.7 61.4,88.75 65.9,88.75 69.15,92 74.45,92 74.7,92.25 78.55,92.25 78.7,92.1 R16.2 | v54.2,80.4 v54.2,80.35 v54.2,80.3 49.09,80.3 42.7,73.91 v42.7,67.75
  route 0.152: v54.2,80.35 v54.2,80.3 58.15,84.25 v58.15,84.85 | v41.15,45.7 41.15,66.25 v42.7,67.75
ANDDRIVE  (via drill 0.35)
  Top 0.152: 18.65,40.23 Q1.P$4 18.55,40.4 v19.9,40.4 | IC1.4 7.75,43.35 8,43.6 8.7,43.6 v9,43.3
  route 0.152: v9,43.3 10.2,43.3 12.4,41.1 19.1,41.1 19.8,40.4 v19.9,40.4
BATT-  (via drill 0.35)
  Top 0.152: U3.4 10.69,40.31 10.7,40.3 10.7,38.4 v10.4,38.1
  other vias: 17.3,36 8.4,36 8.4,40 17.3,39.5 12.9,40 15.1,38.2 12.9,36
  pour Bottom: 7.6,40.7 18,40.7 18,35.3 7.6,35.3
  pour Top (no thermals): 7.5,40.8 18,40.8 18,35.2 7.5,35.2
BETSHUT
  pour Top (no thermals): 16.4,41.3 16.4,46.3 18.7,46.3 18.7,41.3
BGDOUT
  Top 0.152: U3.3 10.66,44 7.1,44 6.8,43.7 IC1.2 6.8,38.1 TP8.P$1
BQBAT
  Top 0.152: U3.5 11.19,41.81 11.5,41.5 12.2,41.5 12.6,41.9 | 12.6,41.9 13.05,41.9 13.38,42.23 | 13.38,42.23 C4.1 | TP5.P$1 13.55,42.05 13.38,42.23 | 12.6,41.9 12.6,46.68 12.3,46.98 11.9,46.98 10.42,45.5 R1.1
BQCOUT  (via drill 0.35)
  Top 0.152: Q2.P$4 15.63,47.23 TP9.P$1 | U3.2 v11.19,44.89 v11.2,44.9
  route 0.152: TP9.P$1 12.9,46.6 v11.2,44.9
BQVMIN  (via drill 0.35)
  Top 0.152: U3.6 11.69,41.78 12.08,41.78 12.32,42.02 12.32,46.28 v12.1,46.5 | R5.1 14.75,48.85 v14.7,48.9
  route 0.152: v12.1,46.5 12.4,46.5 12.78,46.88 13.38,46.88 14.7,48.2 v14.7,48.9
C_SENSE  (via drill 0.35)
  Top 0.152: v48.1,49.25 48.1,48.2 47.65,47.75 44.85,47.75 44.2,47.1 44.2,46.7 U11.6 41.5,46.7 41,47.2 v36,47.2 | TP13.P$1 18.95,47.65 Q2.P$1
  route 0.152: v36,47.2 21.05,47.2 TP13.P$1
  Bottom 0.152: R9.1 49.27,50.77 49.04,51 48.4,51 48.1,50.7 v48.1,49.25
  pour Top (no thermals): 17.1,46.85 17.05,53.4 18.85,53.4 18.85,46.85
CAN_EN  (via drill 0.35)
  Top 0.152: U14.20 77.3,83.45 v77.05,83.2 | U15.5 55.67,79.58 v55.4,79.85
  route 0.152: v77.05,83.2 76,83.2 75.72,82.93 69.63,82.93 65.88,79.18 63.05,79.18 | v55.4,79.85 57,79.85 57.75,79.1 57.75,78.05 58.74,77.06 60.58,77.08 62.68,79.18 63.05,79.18 | 63.05,79.18 62.92,79.18
CAN_LSTN  (via drill 0.35)  (1 unrouted)
  Top 0.152: U14.19 82.1,82.6 v77.7,82.6 | v55.3,77.2 55.3,77.25 55.65,77.6 56.45,77.6
  route 0.152: v77.7,82.6 77.65,82.65 69.75,82.65 66,78.9 62.8,78.9 60.7,76.8 58.3,76.78 57.72,76.2 TP19.P$1 56.3,76.2 v55.3,77.2
CAN_RX  (via drill 0.35)  (1 unrouted)
  Top 0.152: U14.21 85.95,84.25 87.7,86 TP10.P$1 | U15.4 59.88,79.58 v60.15,79.85
  route 0.152: TP10.P$1 78.1,87.2 74.39,83.49 69.4,83.49 65.65,79.74 60.36,79.74 60.25,79.85 v60.15,79.85 | 75.12,84.22 75.28,84.38
CAN_TX  (via drill 0.35)
  Top 0.152: U15.1 59.83,77.62 v60.1,77.9 | v76.4,83.9 79.7,83.9 80.8,85 82.1,85 U14.22 83.37,85.05 83.6,84.82 84.02,84.82 TP22.P$1
  route 0.152: v76.4,83.9 75.98,83.48 75.88,83.48 75.61,83.21 69.52,83.21 65.77,79.46 63.35,79.46 | 63.35,79.46 | 63.35,79.46 63.03,79.46 | 63.03,79.46 | v60.1,77.9 61.01,77.9 62.57,79.46 63.03,79.46
CANH  (via drill 0.35)  (1 unrouted)
  Top 0.152: 40.6,85.1 40.5,85.2 | v72.6,76 72.8,75.8 72.8,25.7 58.58,11.48 55.38,11.48 50.91,7 50.9,7 50.95,6.95 JP2.13 JP2.14 | U15.7 55.38,78.28 v55.3,78.2 | CM1.3 CM1.4 40.59,84.11 v40.7,84
  route 0.152: 55.2,78.2 v55.3,78.2 v52.4,78.2 52.4,79.05 48.44,83.01 48.2,83.3 41.4,83.3 v40.7,84
  Bottom 0.152: v72.6,76 67.23,76 67.2,75.97 | 67.2,75.97 66.22,75 | v52.4,78.2 55.45,75.15 57.3,75.15 58.12,75.97 67.2,75.97
CANL  (via drill 0.35)
  Top 0.152: v73.1,76.7 73.1,25.6 58.7,11.2 55.5,11.2 53.5,9.2 53.5,4.86 53.49,4.85 | U15.6 55.38,78.92 v55.3,79 | CM1.1 CM1.2 41.87,84.44 v42.2,84.1 | 53.49,4.85 JP2.11 | 53.49,4.85 JP2.12
  route 0.152: v55.3,79 v52.9,79 48.32,83.58 42.62,83.58 42.2,84 v42.2,84.1
  Bottom 0.152: v73.1,76.7 72.5,76.7 72.08,76.28 67.85,76.28 67.2,76.93 57.42,76.93 56.67,77.68 53.82,77.68 52.9,78.6 v52.9,79
CHG_CTL
  Top 0.152: CM1.15 CM1.16 32.98,79.78 34.8,77.95 34.8,70.25 36.7,68.35 38.6,68.35 38.65,68.3 38.65,65.4 39.85,64.6 39.85,63.2 40.6,62.45 42.55,62.45 43.3,61.7 43.3,59.9 43.65,59.55 D3.1
CHG_SHD
  Top 0.152: 47.6,63.65 48.4,63.65 49,64.25 50.9,64.25 51.55,63.6 U6.3 52,63.65 52.7,63.65 52.7,67.25 52.25,67.7 U7.3 51.4,67.7 50.75,67.05 49.5,67.05 49.1,67.65 49.05,67.7 U5.3 | TP11.P$1 46.05,63.95 46.8,63.6 47.45,63.6 47.5,63.65
  pour Top (no thermals): 46.9,62.35 46.9,63.2 47,63.3 47,63.9 48.05,63.9 48.05,63.3 47.6,63.3 47.3,63 47.3,62.3 46.9,62.3
DCHG_CTL
  Top 0.152: D2.1 37.25,67.85 37.03,68.07 36.58,68.07 34.52,70.13 34.52,77.83 32.7,79.66 32.7,83.51 31.7,84.5 CM1.18 CM1.17
DSCHG_SHD  (3 unrouted)
  Top 0.152: 15.95,70.8 15.4,70.8 14.8,70.2 14.8,68.05 | 33.6,59.25 33.6,59.55 34.45,60.4 36.5,60.4 U13.3 | 14.8,68.05 12.75,68.05 10.75,66.05 10.75,64.75 14.08,61.42 20.08,61.42 23.09,58.41 25.98,58.41 26.15,58.38 27.84,60.07 32.98,60.07 33.1,59.95 33.1,59.69 U12.3 | U10.3 15.2,66.4 14.8,66.8 14.8,68.05
  pour Top: 38.9,59.8 37.4,59.8 37.4,57.4 38.9,57.4
GND  (via drill 0.35)
  Top 0.152: U9.2 16.55,69.95 v16.6,69.9
  other vias: 73.35,90.7 74.15,90.7 86.25,79.8 86.25,80.6 70.7,79.9 16.5,65.45 41.7,42.45 42.5,42.45 46.75,47.2 45.7,62.6 48.65,64.8 69.6,78.8 67.1,77.3 64.7,77.2 11.3,50.8 11.3,51.4 11.3,52 11.3,52.6
  pour Top (rank 6, no thermals): 8,95.2 8,85.3 2.6,85.3 2.6,4 3.4,3.5 4,3.1 13.6,3.1 14.3,2.4 14.3,0.2 14.4,0.1 84.5,0.1 84.5,2.5 85.1,3.1 95.2,3.1 96,3.9 96,85.3 90.6,85.3 90.6,95.2 46,95.2 45.9,95.3 45.9,93.4 45.2,92.7 14.4,92.7 13.7,93.5 13.7,95.2
  pour Bottom (rank 6, no thermals): 8,95.15 90.3,95.15 90.3,85.25 95.85,85.25 95.85,3.35 83.75,3.35 83.75,0.3 14.45,0.3 14.45,3.45 2.65,3.45 2.65,85.15 8,85.15
  pour Route2: 0.2,88.9 6.3,95 92.1,95 98.3,88.8 98.3,10.2 98.3,10 95.7,10 95.7,3.7 83.9,3.7 83.9,0.4 14.4,0.4 14.4,4 3,4 3,10.1 0.2,10.1
HEAT  (via drill 0.35)
  Top 0.152: v72.8,81.8 73.6,81.8 U14.7 | R21.1 v57,74.4
  route 0.152: v17.35,74.4 v57,74.4 57,74.44 57.8,74.44 59.87,76.51 60.1,76.52 60.7,76.52 60.82,76.52 62.92,78.62 66.12,78.62 69.3,81.8 v72.8,81.8 73.65,81.8
  Bottom 0.152: Q7.P$4 17.07,74.4 v17.35,74.4
INFUSE
  pour Top (no thermals): 45.9,74.15 45.9,70.05 48.1,70.05 48.1,69.35 46.2,69.35 46.1,69.25 46.1,65.95 48.1,65.95 48.1,65.15 44.4,65.15 44.4,74.15
MAX_IO
  Top 0.152: U14.28 78.35,88.75 78.65,89.05 78.65,89.75 R16.1
N$1
  pour Top (no thermals): 58.6,82.6 59.7,82.6 59.85,82.45 60.85,82.45 60.85,83.45 59.75,83.45 59.6,83.3 58.6,83.3
N$2
  Top 0.152: U14.31 75.9,88.9 75.7,89.1 R19.2
N$4
  Top 0.152: U14.18 TP23.P$1
N$7
  Top 0.152: C3.1 56.15,90.5 R3.2 54,90.4 53.15,90.4 52.15,89.4 R2.1 50.65,86.6 50.6,86.55 50.6,82.7 51.35,81.95 54.3,81.95 55.2,81.05 U1.3
N$8  (via drill 0.35)  (1 unrouted)
  Top 0.152: v28.95,72.85 28.85,72.75 28.85,71.95 Q5.4 | 32.6,62.05 32.55,62 | U12.5 v32.6,62.85 32.6,62.9
  route 0.152: v28.95,72.85 28.25,72.2 28.2,65.5 28.57,65.13 28.57,64.63 30.13,63.07 31.88,63.07 32.1,62.85 v32.6,62.85
N$11  (via drill 0.35)  (1 unrouted)
  Top 0.152: 23.95,72.65 23.3,72.65 22.35,73.6 15.45,73.6 13.6,71.75 11.8,71.75 11.2,71.15 11.2,70 12.2,69 U9.6 | Q3.2 23.73,70.62 v23.9,70.45
  Top 0.305: v31.6,58.15 31.6,59.05
  route 0.152: v23.9,70.45 23.9,69.35 26.95,69.35 27.93,68.37 27.93,66.93 27.92,65.61 27.92,65.5 27.92,65.39 27.92,65.38 28,65.3 28.29,65.01 28.29,64.52 30.02,62.79 30.96,62.79 31.6,62.15 v31.6,58.15
  other vias: 23.9,72.65
  pour Top (no thermals): 27.4,73.1 27.4,68.95 22.2,68.95 22.2,71.45 23.5,71.45 23.5,73.1
N$12  (1 unrouted)
  Top 0.152: 13.35,69.85 13.8,69.85 14.35,70.4 14.35,71.85 15.75,73.25 21.8,73.25 22.48,72.58 Q3.4
N$13
  Bottom 0.152: R20.V+ 18.19,74 17.41,73.22 16.74,73.22 16.26,73.7 15.1,73.7
  pour Bottom (no thermals): 14.9,74.2 14.9,73.5 16.6,73.5 16.6,74.2
N$14
  Top 0.152: TP24.P$1 71.82,78.22 71.82,79.8 72.05,80.03 72.05,81.8 72.9,82.65 U14.6
N$16  (via drill 0.35)  (2 unrouted)
  Top 0.152: 28.85,65.6 v28.85,65.65 v28.85,66.5 | v36.65,63 36.65,61.9
  route 0.152: v28.85,66.5 v28.85,65.65 | v36.65,63 36.3,63.35 30.25,63.35 28.85,64.75 v28.85,65.65 | 28.9,65.6 v28.85,65.65
N$18  (via drill 0.35)  (2 unrouted)
  Top 0.152: v35.7,58.1 35.7,59.2 U13.1 | 21.1,61.7 v21.5,61.7 | 21.1,61.7 15.6,61.7 14.4,62.9 14.4,64.3 14.29,64.5 U10.6 | Q4.1 21.88,63.67 21.78,63.58 21.78,62.38 21.1,61.7
  route 0.152: v35.7,58.1 34.93,57.33 30.82,57.33 30.07,58.07 30.07,58.11 26.95,61.23 26.75,61.23 26.27,61.23 25.71,61.23 25.5,61.02 21.98,61.02 v21.5,61.7
  pour Top (no thermals): 27.4,66.65 27.4,62.65 22.2,62.65 22.2,65.15 23.6,65.15 23.6,66.65
N$19  (2 unrouted)
  Top 0.152: 22.45,65.6 21.85,65.6 21.5,65.25 21.5,62.55 21,62.05 15.9,62.05 14.9,63.05 14.9,65.1 14.55,65.45 U10.5
NRESET  (via drill 0.35)
  Top 0.152: U14.4 72.5,84.25 v72.05,84.7 | v77.1,76.18 76.88,75.96 76.88,75.3 76.34,74.76 75.65,74.76 74.53,73.64 74.53,25.04 71.17,21.68 71.17,8.43 73.64,5.96 J2.10
  route 0.152: TP18.P$1 81.6,93 81.6,91.7 78.2,88.3 78.2,87.48 77.98,87.48 75.3,84.8 71.95,84.8 v72.05,84.7
  Bottom 0.152: v72.05,84.7 72.3,84.45 v72.3,79.6 73.7,79.6 77.1,76.2 v77.1,76.18
OSC_IN  (1 unrouted)
  Top 0.152: 70.9,85.85 73,85.85 73.6,85.85 U14.2 | C10.1 70.92,87.72 X1.1
OSC_OUT
  Top 0.152: U14.3 72.8,85.05 72.5,85.25 70.4,85.25 69.78,84.62 X1.3 69.25,84.6 C11.1
OUTFUSE
  pour Top (no thermals): 33.7,74.1 32.2,74.1 32.2,71.35 28.6,71.35 28.6,69.65 30.1,69.65 30.1,65.25 30,65.15 28.7,65.15 28.7,61.45 31.9,61.45 31.9,63.35 35.1,63.35 35.1,61.55 36,61.55 36,65.15 33.7,65.15
REG
  Top 0.152: C9.1 44.2,46.3 U11.7
SCL  (via drill 0.35)
  Top 0.152: U14.29 77.5,90 v77.35,90.15 | R11.1 64.6,87.55 v64.55,87.6 | v70.9,91.3 74.4,91.3 v74.75,91.6 | v64.6,81.7 64.6,81.63 65.23,81 65.23,80.56 68.58,77.22 70,75.8 70,71.66 50.93,52.58 50.93,48.43 49.92,47.42 48.17,47.42 46.74,46 46.42,46 U11.3
  route 0.152: v64.6,81.7 64,81.7 62.9,82.8 62.9,83.7 64.55,85.35 v64.55,87.6 65.94,87.6 69.64,91.3 v70.9,91.3 | TP15.P$1 74.75,92.35 v74.75,91.6 74.92,91.43 76.12,91.43 77.13,90.42 77.13,90.37 v77.35,90.15
SDA  (via drill 0.35)
  Top 0.152: U14.30 76.7,89.3 v76.85,89.45 | v62.45,87.6 R12.1 | v63.7,81.3 64.1,81.3 64.4,81 64.83,81 64.95,80.88 64.95,80.45 69.72,75.68 69.72,71.77 50.65,52.7 50.65,48.55 49.8,47.7 48.05,47.7 46.65,46.3 U11.4
  route 0.152: v76.85,89.45 76.85,90.3 76,91.15 73.45,91.15 71.5,93.1 TP16.P$1 71.2,93.25 66.1,88.15 62.95,88.15 62.45,87.65 v62.45,87.6 62.45,82.55 v63.7,81.3
SPARE1
  Top 0.152: CM1.20 CM1.19
SPARE2
  Top 0.152: CM1.22 CM1.21
SPARE3
  Top 0.152: CM1.24 CM1.23
SPARE4
  Top 0.152: CM1.26 CM1.25
SPARE5
  Top 0.152: CM1.28 CM1.27
SPARE6
  Top 0.152: CM1.30 CM1.29
SPARE7
  Top 0.152: CM1.32 CM1.31
SPARE8
  Top 0.152: CM1.34 CM1.33
SPARE9
  Top 0.152: CM1.36 CM1.35
SPARE10
  Top 0.152: CM1.38 CM1.37
SPARE11
  Top 0.152: CM1.40 CM1.39
SWCLK  (via drill 0.35)
  Top 0.152: J2.4 69.8,4.62 69.83,4.64 69.83,6.3 70.89,7.36 70.89,21.81 71,21.92 71.02,21.92 74.25,25.15 74.25,73.75 75.54,75.04 75.78,75.04 76.24,75.5 v76.4,75.5 | v83.8,85.3 83.8,86 83.2,86.6 82.2,86.6 U14.24
  route 0.152: v83.8,85.3 83.8,85.2 83.53,84.93 83.53,79.63 81.24,77.34 79.13,77.34 78.45,76.66 76.83,76.66 76.39,76.22 76.39,75.52 v76.4,75.5
SWDIO  (via drill 0.35)  (1 unrouted)
  Top 0.152: v75.58,75.52 75.58,75.48 73.94,73.84 73.94,25.24 70.61,21.91 70.61,8.4 68.56,6.35 J2.2 | U14.23 83.2,85.85 v83.25,85.8
  route 0.152: v83.25,85.8 83.25,79.75 81.12,77.62 79.01,77.62 78.33,76.94 76.72,76.94 75.6,75.83 75.6,75.6 75.58,75.6 v75.58,75.52
SYSSHD
  Top 0.152: IC1.1 5.85,38.85 5.1,38.1 5.1,37.1 5.8,36.4 7.3,34.9 20.5,34.9 38.1,50 40.35,50 41.95,51.6 TP7.P$1 41.95,56.37 41.98,56.4 41.98,61.22 D1.2
  pour Top (no thermals): 39.45,53.85 42.85,53.85 42.85,54.95 39.45,54.95
TEMPSENSE  (via drill 0.35)
  Top 0.152: R10.1 v47.8,43.5 47.8,45.45 v47.85,45.5 U11.2
  Bottom 0.152: R9.2 49.3,46.95 v47.85,45.5
THRM
  Top 0.152: U11.9 42.1,45.5 41.8,45.1 41.8,44.05 42.3,43.55 43.28,43.55 43.34,43.5 R10.2
TO_CHG  (via drill 0.35)
  Top 0.152: 48.55,59.85 48.35,59.65 v48.35,58.5 | U14.26 79.9,86.8 v80.1,86.6
  route 0.152: v80.1,86.6 80.1,82.8 78.7,81.4 74.04,81.4 73.68,81.04 72.49,81.04 72.28,81.24 69.53,81.24 69.33,81.04 | 61.05,75.96 61.13,76.04 63.15,78.06 66.35,78.06 69.33,81.04 | 61.05,75.96 | 61.05,75.96 60.94,75.96 60.69,75.96 60.57,75.96 60.59,75.96 | 60.59,75.96 | 60.59,75.96 | 60.59,75.96 60.69,75.96 60.82,75.96 | 61.05,75.96 60.93,75.96 60.82,75.96 | 66.12,78.06 63.15,78.06 61.05,75.96 | 61.05,75.96 | 61.05,75.96 | 61.05,75.96 | 61.05,75.96 | 61.05,75.96 | 60.82,75.96 60.1,75.95 58.22,74.08 54.55,70.41 54.55,68.65 48.4,62.5 48.4,58.55 v48.35,58.5 | 69.33,81.04
  pour Top (no thermals): 46.25,61.3 46.65,61.3 46.65,60.6 46.65,60.45 46.75,60.35 46.75,59.35 46.2,59.35 46.2,60.4 46.25,60.45
  pour Top (no thermals): 49.05,60.25 46.2,60.25 46.2,59.25 49.05,59.25
TO_DCHG  (via drill 0.35)
  Top 0.152: v38.1,64.45 37.75,64.1 37.25,64.1 D2.2 | U14.27 v79.1,86.5 | R8.1 53.45,73.4 v53.3,73.55 | U8.2 37.2,56.5 36.6,57.1 36.02,57.1 34.92,58.2 v34.9,58.2
  route 0.152: v79.1,86.5 79.1,86.3 79.82,85.58 79.82,82.92 78.58,81.68 73.92,81.68 73.56,81.32 72.6,81.32 72.4,81.52 69.41,81.52 66.39,78.5 | v34.9,58.2 38.1,61.4 v38.1,64.45 38.1,64.55 47.1,73.55 v53.3,73.55 53.87,74.12 56.4,74.12 56.6,73.92 57.67,73.92 59.98,76.23 59.99,76.23 60.7,76.24 60.82,76.24 60.93,76.24 63.03,78.34 66.23,78.34 66.39,78.5 | 66.39,78.5
TP21
  Top 0.152: U14.13 TP21.P$1
U3STAT  (via drill 0.35)  (2 unrouted)
  Top 0.152: 63.2,74.2 v63.2,73.25 | 63.2,74.2 63.2,74.35 63.25,74.4 | U14.12 v77.5,78.5 | v68.4,74.8 68.24,74.8 68.08,74.95 63.95,74.95 63.2,74.2 | U4.4 50.8,63.6 51.45,62.95 53,62.95 53.65,63.6 U6.4 54.7,63.55 v55.65,63.55
  route 0.152: v77.5,78.5 76.9,77.9 76.43,77.9 73.18,74.65 68.55,74.65 v68.4,74.8 | v63.2,73.25 63.2,73.08 62.72,72.6 62.72,72.3 56.29,65.87 56.29,64.14 55.65,63.5
U6STAT  (via drill 0.35)  (1 unrouted)
  Top 0.152: v53.2,68.15 53.7,67.65 54.6,67.65 | 61.2,74.2 R17.2 | v76.6,78.5 76.6,78.85 76.7,78.95 U14.11 | v68.7,75.5 68.34,75.5 68.08,75.25 62.65,75.25 62.1,74.7 61.7,74.7 61.2,74.2 | v61.1,72.4 61.1,74.1 61.2,74.2 | U7.4 v55.8,67.7 | U5.4 50.95,67.7 51.05,67.8 51.05,68.2 50.85,68.4 50.8,68.4 v50.65,68.55
  route 0.152: v76.6,78.5 73.25,75.15 69.05,75.15 v68.7,75.5 | v55.8,67.7 56.71,67.7 60.44,71.36 61.1,72.02 v61.1,72.4 | v53.2,68.15 51.05,68.15 v50.65,68.55
U7STAT  (via drill 0.35)  (6 unrouted)
  Top 0.152: v79.1,78.5 79.1,79.55 | 33.6,61.85 33.6,61.4 33,60.75 v26.75,60.75 | U9.4 13.23,70.86 13.18,70.9 12.2,70.9 12,70.7 v12,70.1 | 26.97,60.78 26.7,60.78 25.85,59.93 v25.85,59.8 | v41.5,56.6 v39.6,56.6 | v68.8,74.1 68.8,72.8 68.4,72.4 v63.2,72.4 65.05,74.25
  route 0.152: 39.65,56.58 39.59,56.52 | v41.5,56.6 44.89,56.6 45.65,57.36 50.8,57.38 56.57,63.15 56.57,65.76 63.2,72.39 v63.2,72.4 | v79.1,78.5 78.1,77.5 76.43,77.5 73.01,74.09 | 73.01,74.09 72.99,74.06 | v68.8,74.1 73,74.1 73.01,74.09 | v39.6,56.6 39.43,56.77 30.58,56.77 27.43,59.92 25.96,59.92 v25.85,59.8 | v26.75,60.75 25.62,60.75 25.62,60.74 18.36,60.74 15.7,63.4 15.7,67.5 13.1,70.1 v12,70.1
U9STAT  (via drill 0.35)  (3 unrouted)
  Top 0.152: v79.95,78.5 79.95,78.85 79.9,78.9 79.9,79.65 | U13.4 37.65,61 38,60.65 39.05,60.65 v39.3,60.9 40.57,62.17 42.43,62.17 42.92,61.67 42.92,58.62 44.75,56.8 v47,56.8 | 67.4,74.2 67.4,73.51 67.4,73.5 67.8,73.1 v68,73.1 v64.7,73.1 | v12.3,66.4 U10.4
  route 0.152: v39.3,60.9 39.3,60.85 35.5,57.05 30.7,57.05 27.55,60.2 26.5,60.2 26.23,60.47 25.74,60.47 25.73,60.46 18.24,60.46 15.42,63.28 15.42,65.38 14.4,66.4 v12.3,66.4 | v64.7,73.1 63.35,71.75 63.3,71.8 63.01,71.8 | v79.95,78.5 79.35,77.9 78.89,77.9 78.22,77.22 76.6,77.22 73.08,73.7 69.08,73.7 69,73.62 68.52,73.62 v68,73.1 | 63.01,71.8 | 63.01,71.8 56.85,65.64 56.85,63.4 56.85,63.03 51,57.18 50.92,57.1 | 50.92,57.1 | 50.92,57.1 50.8,57.1 47.6,57.09 47.31,56.8 v47,56.8
USART2_RX
  Top 0.152: 61.15,2.4 62.25,1.3 64.4,1.3 64.95,1.85 64.95,6.03 63.98,7 63.98,15.69 73.66,25.37 73.66,76.19 75.1,77.63 U14.9
  pour Top (no thermals): 60,5.6 60.05,5.6 60.55,6.05 61.65,6.05 62.2,5.5 62.2,1.9 61.65,1.35 60.55,1.35 60,1.9
USART2_TX  (1 unrouted)
  Top 0.152: 73.65,81.1 72.95,81.1 72.8,80.95 72.8,77.68 73.58,76.9 73.58,76.5 73.38,76.3 73.38,25.48 63.7,15.8 63.7,5
  pour Top (no thermals): 62.55,5.5 63.1,6.05 64.2,6.05 64.75,5.5 64.75,1.95 64.2,1.35 63.15,1.35 62.55,1.9
V_BATT  (via drill 0.35)  (2 unrouted)
  Top 0.152: R4.2 54.23,61.45 54.99,62.21 56.13,62.21 56.13,65.5 U6.5 54.65,65.23
  other vias: 17.25,63.45 42.65,44.85 55.45,83.05 54.7,83.05 53.9,83.05 12.3,59.6 10.3,59.6 8.1,59.6 8.1,61.9 49.3,76.2 49.3,77 50.4,77 50.4,76.2 53.1,83.05 16.7,71.9 16.7,72.5 15.7,72.5 15.7,71.9 17.25,64.15 16.55,63.45 36.6,54.8 36.6,54.1 10.4,61.9 12.3,61.9
  pour Top (no thermals): 15.3,72.85 19.3,72.85 19.3,63.05 15.3,63.05 15.3,64.75 17.2,64.75 17.2,68.35 15.3,68.35
  pour Top (no thermals): 46.9,60.6 49.05,60.6 49.05,61.95 48,61.95 47.95,61.9 47.95,61.55 46.95,61.55 46.9,61.5
  pour Top (no thermals): 51.35,85.3 56.95,85.3 56.95,82.65 51.35,82.65
  pour Top (no thermals): 54.15,65.25 57.75,65.25 57.75,72.05 54.05,72.05 54.05,69.3 56.35,69.3 56.35,66.15 54.2,66.15 54.15,66.1
  pour Top (no thermals): 42.25,45.15 44.3,45.15 44.3,44.6 43.1,44.6 43.1,44 42.25,44
  pour Top (rank 3, no thermals): 7.5,59.3 7.5,62.3 12.9,62.3 12.9,59.3
  pour Top (rank 3, no thermals): 7,45 5,45 5,61.3 7,61.3
  pour Top (rank 3, no thermals): 5,62.3 5,59.3 9,59.3 9,62.3
  pour Top (no thermals): 6.3,42.4 6.3,45 6.1,45 5.4,45 5.4,42.4
  pour Bottom (rank 3, no thermals): 7.5,62.3 9.6,62.3 9.6,75.7 51,75.7 51,77.6 7.5,77.6
  pour Top (rank 3, no thermals): 48.8,77.6 50.9,77.6 50.9,72.2 57.8,72.2 57.8,70.1 48.8,70.1
  pour Top (rank 3, no thermals): 46.9,60.5 56.9,60.5 58.1,61.7 58.1,65.2 56,65.2 56,62.6 46.9,62.6
  pour Bottom: 48.7,75.7 51.1,75.7 51.1,82.5 56.1,82.5 56.1,84.6 48.6,84.6 48.6,75.7
  pour Top (rank 3, no thermals): 5.1,56.3 38.6,56.3 38.6,53.9 5.1,53.9
  pour Bottom (rank 3, no thermals): 17.3,70.6 17.3,72.8 7.5,72.8 7.5,70.6
  pour route: 36.4,56.3 36.4,43.4 44.4,43.5 44.4,45.2 38.5,45.2 38.5,56.4
VSOLAR  (4 unrouted)
  pour Top (no thermals): 37.1,78.9 40.9,78.9 40.9,69.35 37.1,69.35
  pour Top (rank 3, no thermals): 33.9,87 36,87 36,84.6 36,83 39.3,79.7 39.3,77.8 37.2,77.8 37.2,78.4 37.2,78.9 33.9,82.2

### Text on the board
tNames: Serial: